# Altium schematic sheet USB.SchDoc
size A2
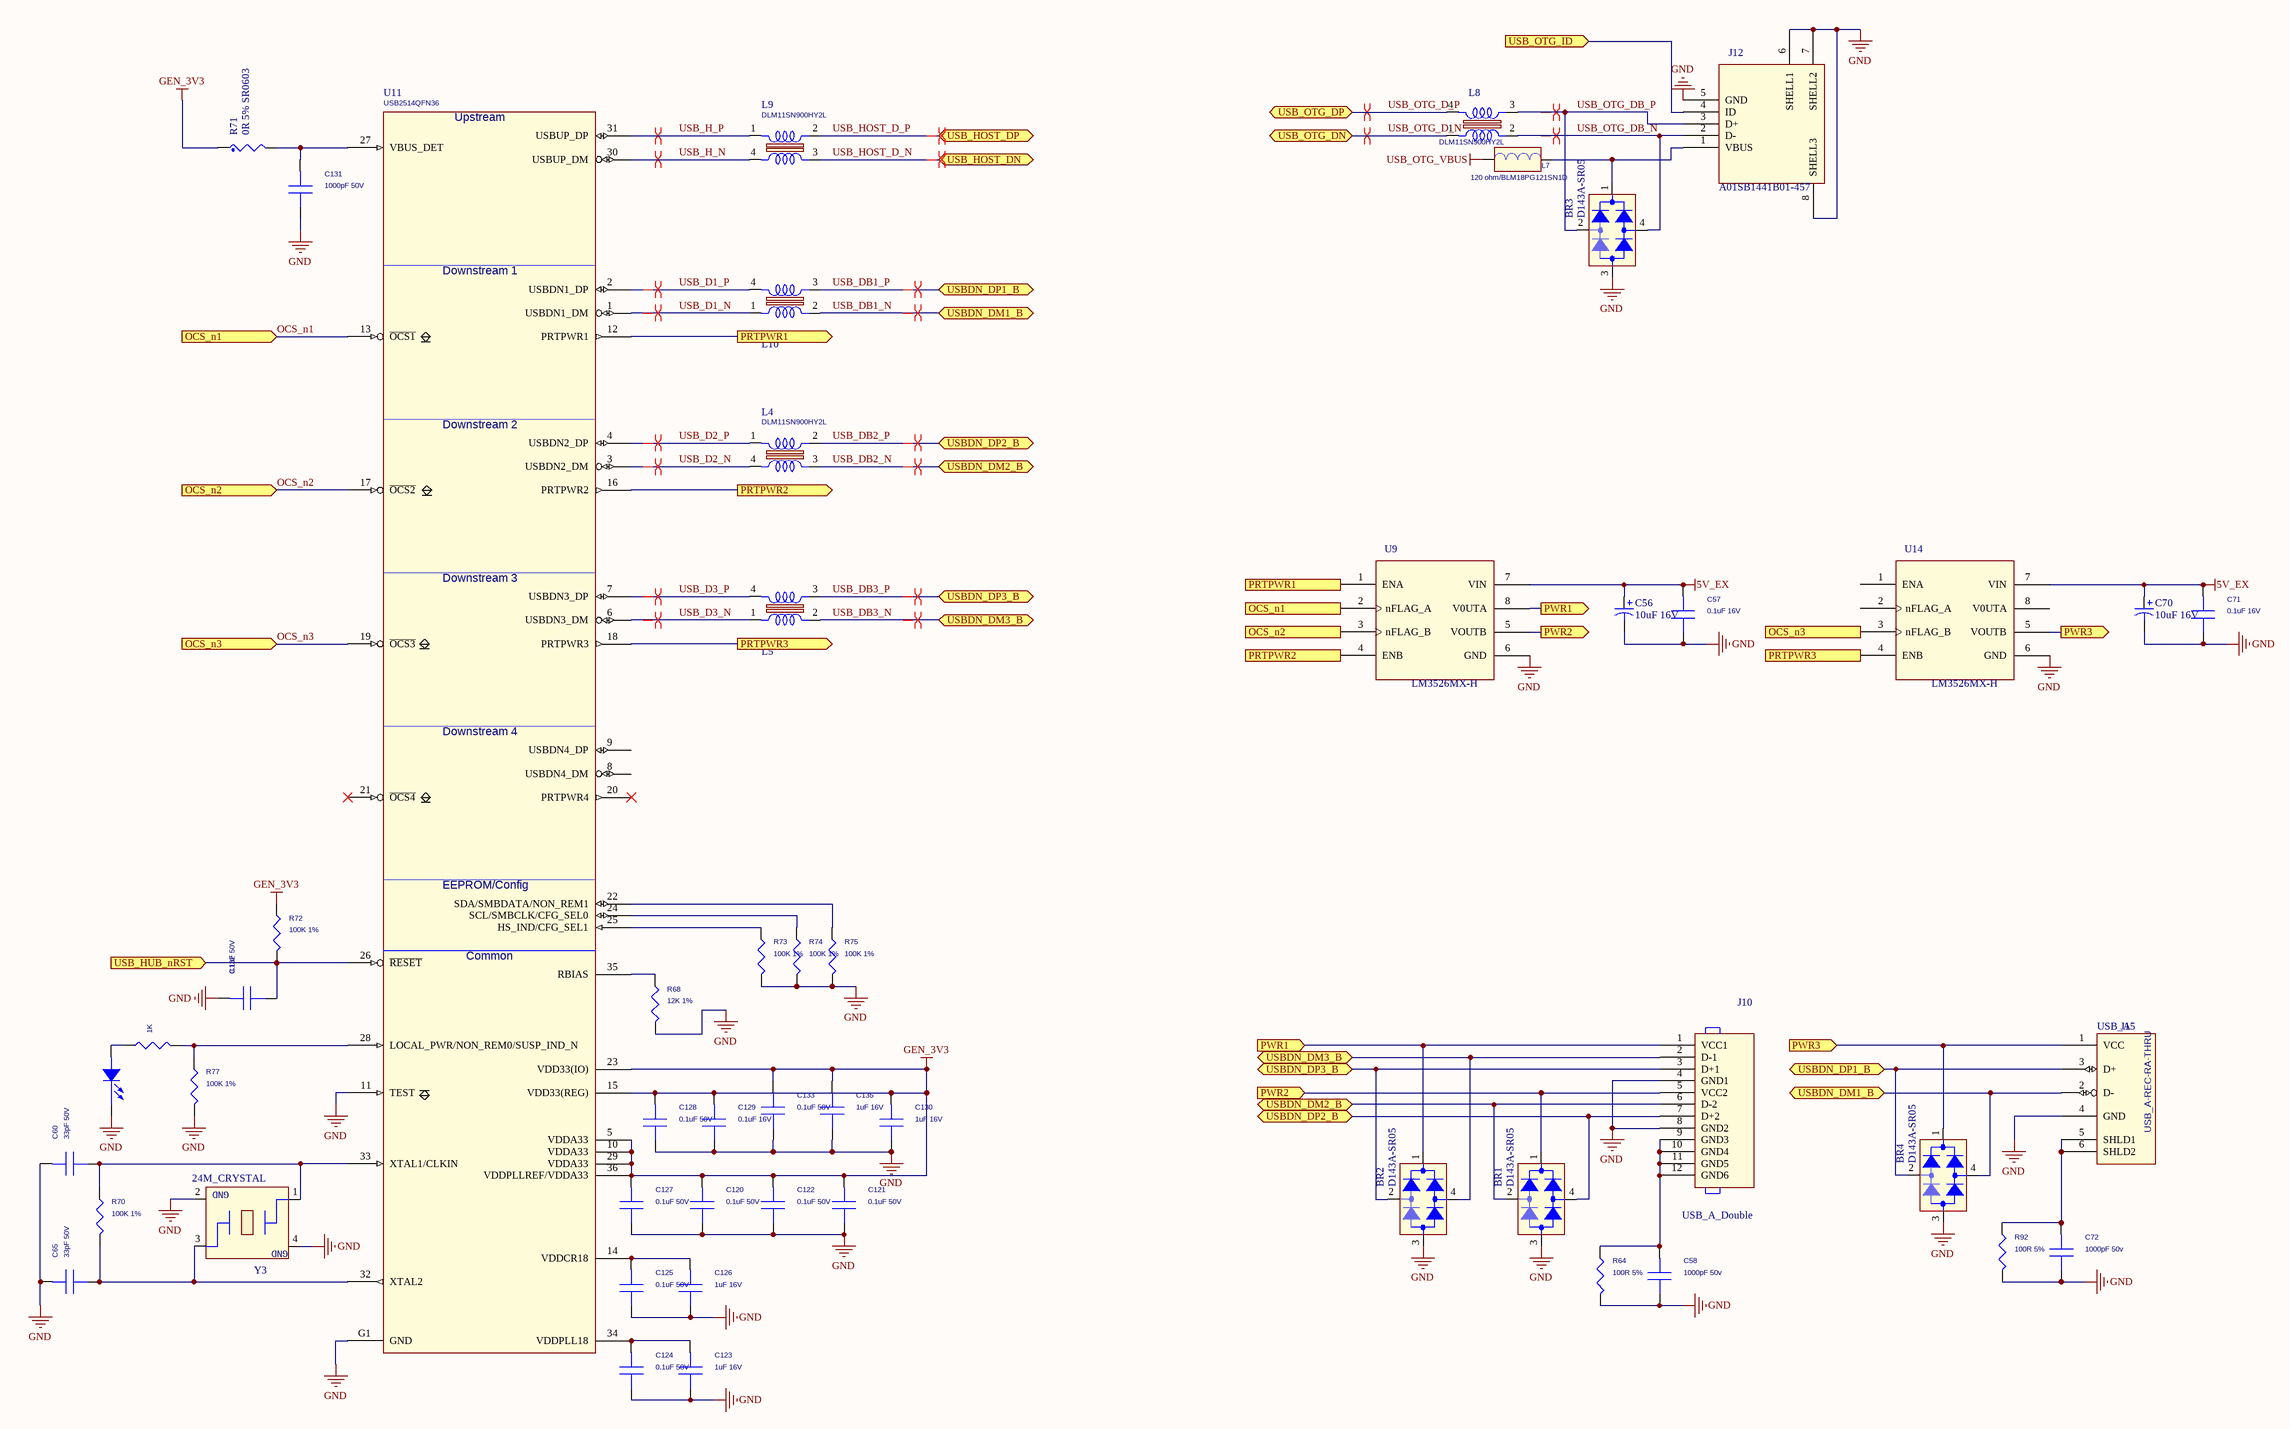
[diagram p0: USB.SchDoc]

## Parts
BR1  D143A-SR05  [SOT143]
BR2  D143A-SR05  [SOT143]
BR3  D143A-SR05  [SOT143]
BR4  D143A-SR05  [SOT143]
C56  10uF 16V  [SC0805]
C57  0.1uF 16V  [SC0603]
C58  1000pF 50v  [SC0603]
C60  33pF 50V  [SC0603]
C65  33pF 50V  [SC0603]
C70  10uF 16V  [SC0805]
C71  0.1uF 16V  [SC0603]
C72  1000pF 50v  [SC0603]
C120  0.1uF 50V  [SC0603]
C121  0.1uF 50V  [SC0603]
C122  0.1uF 50V  [SC0603]
C123  1uF 16V  [SC0603]
C124  0.1uF 50V  [SC0603]
C125  0.1uF 50V  [SC0603]
C126  1uF 16V  [SC0603]
C127  0.1uF 50V  [SC0603]
C128  0.1uF 50V  [SC0603]
C129  0.1uF 16V  [SC0603]
C130  1uF 16V  [SC0603]
C131  1000pF 50V  [SC0603]
C132  0.1uF 50V  [SC0603]
C133  0.1uF 50V  [SC0603]
C135  1uF 16V  [SC0603]
D15  LED_RED  [SD0603]  (value not drawn)
J10  USB_A_Double  [DUSB-TYPEA-LIANSHENG]
J12  A01SB1441B01-457  [USB-MICRO-B-LIANSHENG-C]
J15  USB_A  [USB-TYPBEA-ZXHS-V]
L4  DLM11SN900HY2L  [SPM2P1X1P3]
L5  DLM11SN900HY2L  [SPM2P1X1P3]
L7  120 ohm/BLM18PG121SN1D  [SFB0603]
L8  DLM11SN900HY2L  [SPM2P1X1P3]
L9  DLM11SN900HY2L  [SPM2P1X1P3]
L10  DLM11SN900HY2L  [SPM2P1X1P3]
R64  100R 5%  [SR0603]
R68  12K 1%  [SR0603]
R70  100K 1%  [SR0603]
R71  0R 5% SR0603  [SR0603]
R72  100K 1%  [SR0603]
R73  100K 1%  [SR0603]
R74  100K 1%  [SR0603]
R75  100K 1%  [SR0603]
R76  1K  [SR0603]
R77  100K 1%  [SR0603]
R92  100R 5%  [SR0603]
U9  LM3526MX-H  [SOP8-1p27-5x4]
U11  Device: USB2514QFN36  [QFP36-0P5-6X6]  (hidden comment: USB2514_QFN36_0)
U14  LM3526MX-H  [SOP8-1p27-5x4]
Y3  24M_CRYSTAL  [SCRY4-3P2X2P5]

## Ports
OCS_n1 (in), OCS_n1 (out), OCS_n2 (in), OCS_n2 (out), OCS_n3 (in), OCS_n3 (out), PRTPWR1 (out), PRTPWR2 (out), PRTPWR3 (out), PWR1 (in), PWR1 (out), PWR2 (in), PWR2 (out), PWR3 (in), PWR3 (out), USB_HOST_DN (bidir), USB_HOST_DP (bidir), USB_HUB_nRST (in), USB_OTG_DN (bidir), USB_OTG_DP (bidir), USB_OTG_ID (in), USBDN_DM1_B (bidir), USBDN_DM2_B (bidir), USBDN_DM3_B (bidir), USBDN_DP1_B (bidir), USBDN_DP2_B (bidir), USBDN_DP3_B (bidir)

## Nets
5V_EX: C56.1 C57.1 C70.1 C71.1 U9.7(VIN) U14.7(VIN)
GEN_3V3: C120.1 C121.1 C122.1 C127.1 C128.1 C129.1 C130.1 C133.1 C135.1 R71.1 R72.1 U11.5(VDDA33) U11.10(VDDA33) U11.15(VDD33(REG)) U11.23(VDD33(IO)) U11.29(VDDA33) U11.36(VDDPLLREF/VDDA33)
GND: BR1.3 BR2.3 BR3.3 BR4.3 C56.2 C57.2 C58.2 C60.1 C65.1 C70.2 C71.2 C72.2 C120.2 C121.2 C122.2 C123.2 C124.2 C125.2 C126.2 C127.2 C128.2 C129.2 C130.2 C131.2 C132.1 C133.2 C135.2 D15.2(CATHODE) J10.4(GND1) J10.8(GND2) J12.5(GND) J12.6(SHELL1) J12.7(SHELL2) J12.8(SHELL3) J15.4(GND) R64.2 R68.2 R73.2 R74.2 R75.2 R77.2 R92.2 U9.6(GND) U11.11(TEST) U11.G1(GND) U14.6(GND) Y3.2(GND2) Y3.4(GND1)
USB_OTG_VBUS: L7.1
OCS_n1: U9.2(nFLAG_A) U11.13(~{OCS1}) ; port OCS_n1
OCS_n2: U9.3(nFLAG_B) U11.17(~{OCS2}) ; port OCS_n2
OCS_n3: U11.19(~{OCS3}) U14.3(nFLAG_B) ; port OCS_n3
PRTPWR1: U9.1(ENA) U11.12(PRTPWR1) ; port PRTPWR1
PRTPWR2: U9.4(ENB) U11.16(PRTPWR2) ; port PRTPWR2
PRTPWR3: U11.18(PRTPWR3) U14.4(ENB) ; port PRTPWR3
PWR1: BR2.1 J10.1(VCC1) U9.8(V0UTA) ; port PWR1
PWR2: BR1.1 J10.5(VCC2) U9.5(VOUTB) ; port PWR2
PWR3: BR4.1 J15.1(VCC) U14.5(VOUTB) ; port PWR3
USB_D1_N: L10.1 U11.1(USBDN1_DM)
USB_D1_P: L10.4 U11.2(USBDN1_DP)
USB_D2_N: L4.4 U11.3(USBDN2_DM)
USB_D2_P: L4.1 U11.4(USBDN2_DP)
USB_D3_N: L5.1 U11.6(USBDN3_DM)
USB_D3_P: L5.4 U11.7(USBDN3_DP)
USB_DB1_N: BR4.4 J15.2(D-) L10.2 ; port USBDN_DM1_B
USB_DB1_P: BR4.2 J15.3(D+) L10.3 ; port USBDN_DP1_B
USB_DB2_N: BR1.2 J10.6(D-2) L4.3 ; port USBDN_DM2_B
USB_DB2_P: BR1.4 J10.7(D+2) L4.2 ; port USBDN_DP2_B
USB_DB3_N: BR2.4 J10.2(D-1) L5.2 ; port USBDN_DM3_B
USB_DB3_P: BR2.2 J10.3(D+1) L5.3 ; port USBDN_DP3_B
USB_H_N: L9.4 U11.30(USBUP_DM)
USB_H_P: L9.1 U11.31(USBUP_DP)
USB_HOST_D_N: L9.3 ; port USB_HOST_DN
USB_HOST_D_P: L9.2 ; port USB_HOST_DP
USB_HUB_nRST: C132.2 R72.2 U11.26(~{RESET}) ; port USB_HUB_nRST
USB_OTG_D_N: L8.1 ; port USB_OTG_DN
USB_OTG_D_P: L8.4 ; port USB_OTG_DP
USB_OTG_DB_N: BR3.4 J12.2(D-) L8.2
USB_OTG_DB_P: BR3.2 J12.3(D+) L8.3
USB_OTG_ID: J12.4(ID) ; port USB_OTG_ID
NetBR3_1: BR3.1 J12.1(VBUS) L7.2
NetC58_1: C58.1 J10.9(GND3) J10.10(GND4) J10.11(GND5) J10.12(GND6) R64.1
NetC60_2: C60.2 R70.1 U11.33(XTAL1/CLKIN) Y3.1
NetC65_2: C65.2 R70.2 U11.32(XTAL2) Y3.3
NetC72_1: C72.1 J15.5(SHLD1) J15.6(SHLD2) R92.1
NetC123_1: C123.1 C124.1 U11.34(VDDPLL18)
NetC125_1: C125.1 C126.1 U11.14(VDDCR18)
NetC131_1: C131.1 R71.2 U11.27(VBUS_DET)
NetD15_1: D15.1(ANODE) R76.1
NetR68_1: R68.1 U11.35(RBIAS)
NetR73_1: R73.1 U11.25(HS_IND/CFG_SEL1)
NetR74_1: R74.1 U11.24(SCL/SMBCLK/CFG_SEL0)
NetR75_1: R75.1 U11.22(SDA/SMBDATA/NON_REM1)
NetR76_2: R76.2 R77.1 U11.28(LOCAL_PWR/NON_REM0/SUSP_IND_N)

Not connected (* = marked no-connect by the designer): U11 8(USBDN4_DM) 9(USBDN4_DP) 20(PRTPWR4)* 21(~{OCS4})*; U14 1(ENA) 2(nFLAG_A) 8(V0UTA)

## Layout directives
differential pair: USB_D1_N, USB_D1_P, USB_D2_N, USB_D2_P, USB_D3_N, USB_D3_P, USB_DB1_N, USB_DB1_P, USB_DB2_N, USB_DB2_P, USB_DB3_N, USB_DB3_P, USB_H_N, USB_H_P, USB_HOST_D_N, USB_HOST_D_P, USB_OTG_D_N, USB_OTG_D_P, USB_OTG_DB_N, USB_OTG_DB_P

## Notes on the sheet
- (in symbol 24M_CRYSTAL) GND
- (in symbol SKT_USB-A_THRU_RA_0) USB_A-REC-RA-THRU
- (in symbol USB2514_QFN36_0) Upstream; Downstream 1; Downstream 2; Downstream 3; Downstream 4; EEPROM/Config; Common

## Library data of the parts
BR1-BR4 = DIO_BRIDGE_BGX50A_KCAC_SOT143: SOT143; Cost_100: 0.165; Cost_10: 0.234; Cost_1K: 0.075; Cost_Reel: 0.06113; Dist1: Digikey; Dist1_PN: BGX50AINCT-ND; Device: DIODE_KCAC_BRIDGE_BGX50A; Mfg1: Infineon Tech; Mfg1_PN: BGX50A; DNP: No
C56 C70 = Cap Pol1: Polarized Capacitor (Radial); Published: 8-Jun-2000; LatestRevisionDate: 17-Jul-2002; LatestRevisionNote: Re-released for DXP Platform.; PackageReference: RB7.6-15; Publisher: Altium Limited
C57 C58 C60 C65 C71 C72 C120-C122 C124 C125 C127-C129 C131-C133 = 0.1uF-6.3V-10%-X5R-0402: Capacitor, 0.1uF, 50V, 10%, X5R, 0603; Cost_100: 0.0184; Cost_1K: 0.01005; Dist1: Digikey; Dist1_PN: PCC2146CT-ND; Device: CAP0402; Mfg1_PN: ECJ-0EB1A104K; Mfg1: Panasonic; Voltage: 6.3V; Cost_Reel: 0.00871; Mfg2_PN: MCCJ104K0NRTF; DNP: No; Cost: 0.026; Dielectric: X5R; TOLERANCE: 10%; Mfg2: SMEC
C123 C126 = 0.1uF-6.3V-10%-X5R-0402: Capacitor, 1uF, 16V, 10%, X5R, 0603; Cost_100: 0.0184; Cost_1K: 0.01005; Dist1: Digikey; Dist1_PN: PCC2146CT-ND; Device: CAP0402; Mfg1_PN: ECJ-0EB1A104K; Mfg1: Panasonic; Voltage: 6.3V; Cost_Reel: 0.00871; Mfg2_PN: MCCJ104K0NRTF; DNP: No; Cost: 0.026; Dielectric: X5R; TOLERANCE: 10%; Mfg2: SMEC
C130 = 0.1uF-6.3V-10%-X5R-0402: Capacitor,1uF, 16V, 10%, X5R, 0603; Cost_100: 0.0184; Cost_1K: 0.01005; Dist1: Digikey; Dist1_PN: PCC2146CT-ND; Device: CAP0402; Mfg1_PN: ECJ-0EB1A104K; Mfg1: Panasonic; Voltage: 6.3V; Cost_Reel: 0.00871; Mfg2_PN: MCCJ104K0NRTF; DNP: No; Cost: 0.026; Dielectric: X5R; TOLERANCE: 10%; Mfg2: SMEC
C135 = 0.1uF-6.3V-10%-X5R-0402: Capacitor, 1uF, 50V, 10%, X5R, 0603; Cost_100: 0.0184; Cost_1K: 0.01005; Dist1: Digikey; Dist1_PN: PCC2146CT-ND; Device: CAP0402; Mfg1_PN: ECJ-0EB1A104K; Mfg1: Panasonic; Voltage: 6.3V; Cost_Reel: 0.00871; Mfg2_PN: MCCJ104K0NRTF; DNP: No; Cost: 0.026; Dielectric: X5R; TOLERANCE: 10%; Mfg2: SMEC
D15 = LED
J10 = 12 HEADER_0: DUSB-TypeA-LianSheng
J12 = MICRO_USB_CONN_0: USB-Micro-B-LianSheng-C; CLASS: IO
J15 = SKT_USB-A_THRU_RA_0: USB-TypbeA-ZXHS-V; Cost_Reel: 0.6205; Dist1: Digikey; Dist1_PN: 787616-1-ND; Mfg1_PN: 787616-1; Mfg2_PN: USB-A-S-RA; Mfg1: AMP; SDTSourceLibName: C:\WINDOWS\EFE9203.LIB; Cost_100: 0.7476; DNP: No; Cost: 1.12; Mfg2: Adam Tech; Device: SKT_USB-A; Cost_1K: 0.6205
L4 L5 L9 L10 = CHOKE_C-MODE_0: Inductor, Common Mode Choke, DLP11SN900SL2, 0504; Cost_100: 0.32; Cost_1K: 0.26; Dist1_PN: 81-DLP11SN900SL2L; Mfg1: Murata; Dist1: Mouser; Device: 0504CHOKE; DNP: No; Mfg2_PN: EXC-24CE201U; Cost: 0.56; Mfg1_PN: DLP11SN900SL2; Mfg2: Panasonic
L7 = BEAD: SFB0603
L8 = CHOKE_C-MODE_0: SPM2p1x1p3; Cost_100: 0.32; Cost_1K: 0.26; Dist1_PN: 81-DLP11SN900SL2L; Mfg1: Murata; Dist1: Mouser; Mfg1_PN: DLP11SN900SL2; Device: 0504CHOKE; DNP: No; Mfg2_PN: EXC-24CE201U; Cost: 0.56; Mfg2: Panasonic
R64 R92 = 100K-1/16W-5%-0603: Resistor, 100K, 1%, 0603; DNP: No; Cost_100: 0.0412; Cost_1K: 0.01612; Cost_Reel: 0.02365; Dist1: Digikey; Dist1_PN: 311-100KGCT-ND; Wattage: 1/16W; Device: RES0603; Mfg1: Yageo America; Mfg2_PN: MCR03EZHJ104; Mfg1_PN: 9C06031A1003JLHFT; Cost: 0.076; Tolerance: 5%; Mfg2: Rohm
R68 R70 R72-R75 R77 = 100K-1/16W-5%-0603: Resistor, 100K, 1%, 0603; DNP: No; Cost_100: 0.0412; Cost_1K: 0.01612; Cost_Reel: 0.02365; Dist1: Digikey; Dist1_PN: 311-100KGCT-ND; Wattage: 1/16W; Tolerance: 5%; Device: RES0603; Mfg1: Yageo America; Mfg2_PN: MCR03EZHJ104; Mfg1_PN: 9C06031A1003JLHFT; Cost: 0.076; Mfg2: Rohm
R71 = RES: CLASS: DISCRETE
R76 = 1.0K-1/16W-5%-0603: Resistor, 1K, 5%, 1/16W, 0603; DNP: No; Mfg3_PN: RK73B1JLTD102J; Dist1: Digikey; Dist1_PN: 311-1.0KGCT-ND; Mfg1_PN: 9C06031A1001JLHFT; Mfg2_PN: MCR03EZHJ102; Mfg1: Yageo America; Device: RES0603; Cost_Reel: 0.00468; Cost_1K: 0.01612; Cost_100: 0.0412; Mfg3: KOA Speer; Cost: 0.076; Mfg2: KOA Speer; Tolerance: 5%; Wattage: 1/16W
U9 U14 = LM3526-L: SOP8-1p27-5x4
U11 = USB2514_QFN36_0: IC, USB2514, 4 Port USB 2.0 Hub, QFN36; Mfg1_PN: USB2514-AEZG; Mfg1: SMSC; Cost_Reel: 0; DNP: No; Cost: 0; Cost_1K: 0; Cost_100: 0
Y3 = 24M_CRYSTAL: SCRY4-3p2x2p5